# Altium schematic sheet TOP_LEVEL.SchDoc
size A3; Organization: ICNS, MARCS Institute; Address1: Werrington South Campus, Great Western Highway; Address2: Werrington, NSW, 2747; SheetNumber: 1; SheetTotal: 16
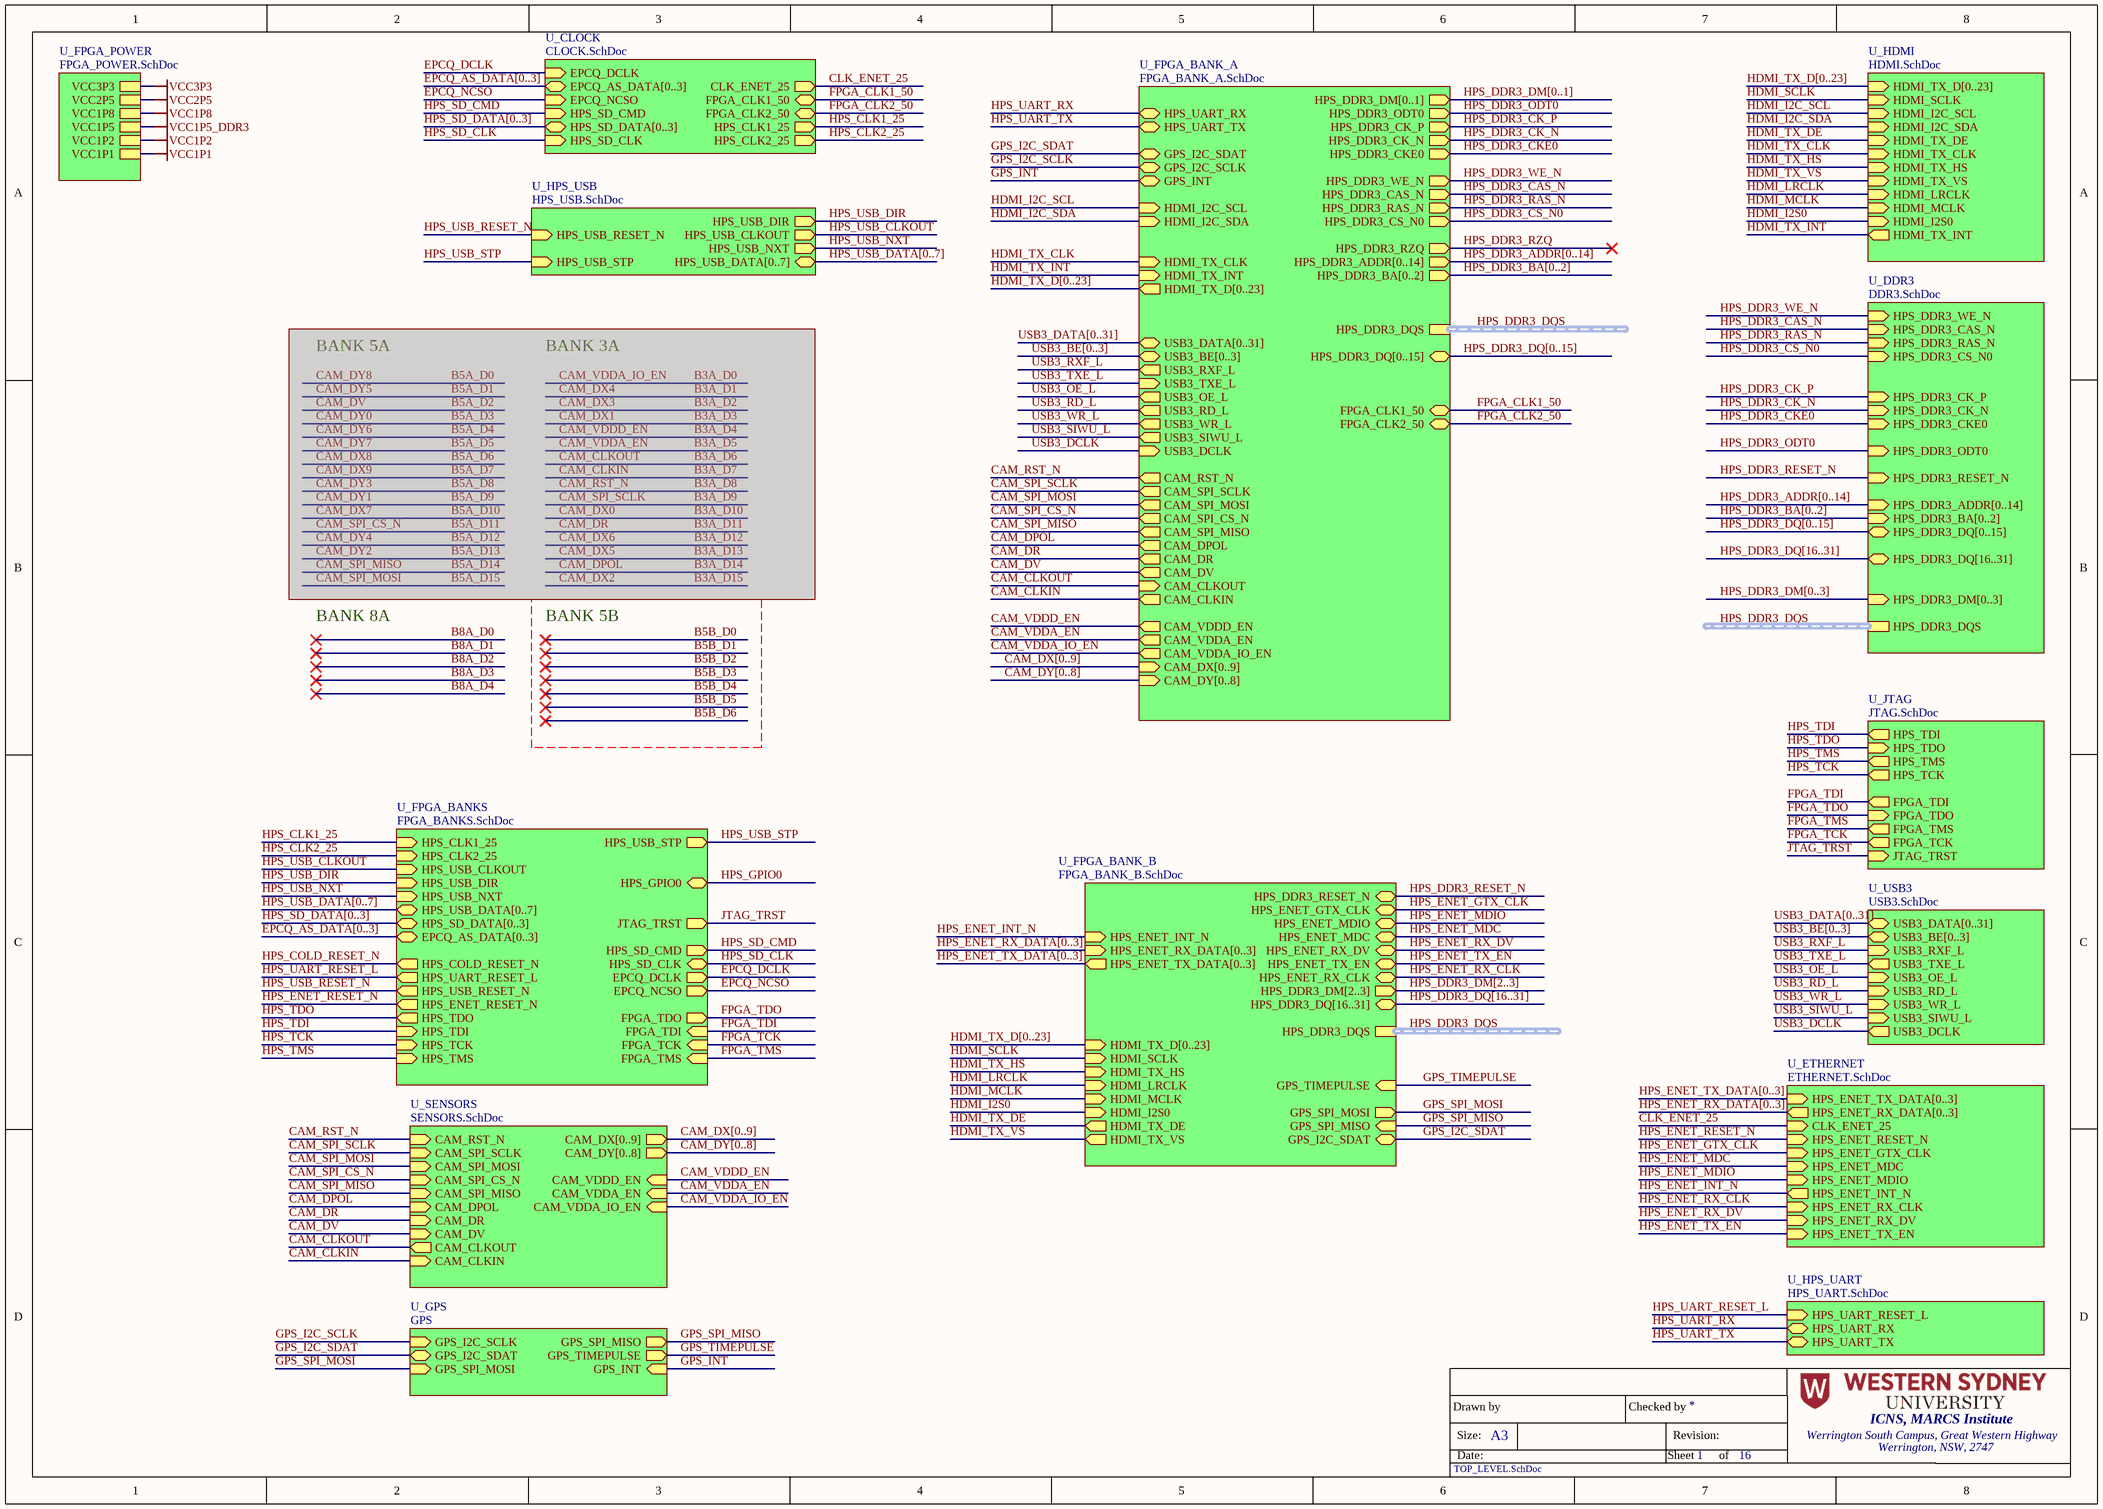
[diagram p0: TOP_LEVEL.SchDoc]

## Sub-sheets
U_CLOCK = CLOCK.SchDoc: CLK_ENET_25 (out), FPGA_CLK1_50 (bidir), FPGA_CLK2_50 (bidir), EPCQ_DCLK (in), EPCQ_AS_DATA[0..3] (bidir), EPCQ_NCSO (in), HPS_SD_CMD (in), HPS_SD_DATA[0..3] (bidir), HPS_SD_CLK (in), HPS_CLK1_25 (out), HPS_CLK2_25 (out)
U_DDR3 = DDR3.SchDoc: HPS_DDR3_WE_N (in), HPS_DDR3_CAS_N (in), HPS_DDR3_RAS_N (in), HPS_DDR3_CS_N0 (in), HPS_DDR3_CK_P (in), HPS_DDR3_CK_N (in), HPS_DDR3_CKE0 (in), HPS_DDR3_ODT0 (in), HPS_DDR3_RESET_N (in), HPS_DDR3_ADDR[0..14] (in), HPS_DDR3_BA[0..2] (in), HPS_DDR3_DQ[0..15] (bidir), HPS_DDR3_DQ[16..31] (bidir), HPS_DDR3_DM[0..3] (in), HPS_DDR3_DQS (harness DQS)
U_ETHERNET = ETHERNET.SchDoc: HPS_ENET_TX_DATA[0..3] (in), HPS_ENET_RX_DATA[0..3] (out), CLK_ENET_25 (in), HPS_ENET_RESET_N (in), HPS_ENET_GTX_CLK (in), HPS_ENET_MDC (in), HPS_ENET_MDIO (in), HPS_ENET_INT_N (out), HPS_ENET_RX_CLK (in), HPS_ENET_RX_DV (in), HPS_ENET_TX_EN (in)
U_FPGA_BANK_A = FPGA_BANK_A.SchDoc: HPS_UART_RX (bidir), HPS_UART_TX (bidir), GPS_I2C_SDAT (bidir), GPS_I2C_SCLK (bidir), FPGA_CLK1_50 (bidir), HPS_DDR3_DM[0..1] (out), HPS_DDR3_ODT0 (out), HPS_DDR3_CK_P (out), HPS_DDR3_CK_N (out), HPS_DDR3_CKE0 (out), HPS_DDR3_WE_N (out), HPS_DDR3_CAS_N (out), HPS_DDR3_RAS_N (out), HPS_DDR3_CS_N0 (out), HPS_DDR3_RZQ (out), HPS_DDR3_ADDR[0..14] (out), HPS_DDR3_DQ[0..15] (bidir), HPS_DDR3_BA[0..2] (out), FPGA_CLK2_50 (bidir), GPS_INT (bidir), HDMI_I2C_SCL (in), HDMI_I2C_SDA (in), HPS_DDR3_DQS (harness HPS_DDR3_DQS), HDMI_TX_CLK (in), USB3_DATA[0..31] (bidir), USB3_BE[0..3] (bidir), USB3_RXF_L (out), USB3_DCLK (in), USB3_TXE_L (in), USB3_OE_L (out), USB3_WR_L (out), USB3_SIWU_L (out), USB3_RD_L (out), HDMI_TX_D[0..23] (out), HDMI_TX_INT (in), CAM_SPI_SCLK (out), CAM_DPOL (out), CAM_SPI_CS_N (out), CAM_RST_N (out), CAM_SPI_MOSI (out), CAM_CLKIN (out), CAM_SPI_MISO (out), CAM_CLKOUT (in), CAM_DR (out), CAM_VDDA_EN (out), CAM_DV (out), CAM_VDDD_EN (out), CAM_DY[0..8] (in), CAM_VDDA_IO_EN (out), CAM_DX[0..9] (in)
U_FPGA_BANK_B = FPGA_BANK_B.SchDoc: HPS_DDR3_RESET_N (bidir), HPS_DDR3_DQ[16..31] (bidir), HPS_ENET_GTX_CLK (bidir), HPS_ENET_MDIO (bidir), HPS_ENET_MDC (bidir), HPS_ENET_RX_DV (bidir), HPS_ENET_TX_EN (bidir), HPS_ENET_RX_CLK (bidir), HPS_ENET_INT_N (in), HPS_ENET_TX_DATA[0..3] (out), HPS_ENET_RX_DATA[0..3] (in), HPS_DDR3_DM[2..3] (out), HPS_DDR3_DQS (harness HPS_DDR3_DQS), HDMI_SCLK (in), HDMI_TX_HS (in), HDMI_LRCLK (in), HDMI_MCLK (in), HDMI_I2S0 (in), GPS_SPI_MISO (in), GPS_SPI_MOSI (out), HDMI_TX_D[0..23] (in), HDMI_TX_DE (out), HDMI_TX_VS (out), GPS_TIMEPULSE (in), GPS_I2C_SDAT (bidir)
U_FPGA_BANKS = FPGA_BANKS.SchDoc: HPS_USB_CLKOUT (in), HPS_USB_STP (out), HPS_USB_DIR (in), HPS_USB_NXT (in), HPS_USB_DATA[0..7] (bidir), HPS_GPIO0 (bidir), HPS_TMS (in), HPS_TCK (in), HPS_TDO (out), HPS_TDI (in), JTAG_TRST (out), FPGA_TDI (in), FPGA_TDO (out), FPGA_TCK (in), FPGA_TMS (in), HPS_SD_CMD (out), HPS_SD_CLK (bidir), HPS_SD_DATA[0..3] (bidir), EPCQ_DCLK (out), EPCQ_NCSO (out), EPCQ_AS_DATA[0..3] (bidir), HPS_COLD_RESET_N (out), HPS_CLK1_25 (in), HPS_CLK2_25 (in), HPS_UART_RESET_L (out), HPS_USB_RESET_N (out), HPS_ENET_RESET_N (out)
U_FPGA_POWER = FPGA_POWER.SchDoc: VCC3P3, VCC2P5, VCC1P8, VCC1P5, VCC1P2, VCC1P1
U_GPS = GPS: GPS_TIMEPULSE (out), GPS_I2C_SDAT (bidir), GPS_SPI_MISO (out), GPS_I2C_SCLK (in), GPS_SPI_MOSI (in), GPS_INT (in)
U_HDMI = HDMI.SchDoc: HDMI_TX_D[0..23] (in), HDMI_SCLK (in), HDMI_I2C_SDA (in), HDMI_TX_DE (in), HDMI_TX_CLK (in), HDMI_TX_HS (in), HDMI_TX_VS (in), HDMI_LRCLK (in), HDMI_MCLK (in), HDMI_I2S0 (in), HDMI_I2C_SCL (in), HDMI_TX_INT (out)
U_HPS_UART = HPS_UART.SchDoc: HPS_UART_RESET_L (in), HPS_UART_RX (bidir), HPS_UART_TX (bidir)
U_HPS_USB = HPS_USB.SchDoc: HPS_USB_RESET_N (in), HPS_USB_DATA[0..7] (bidir), HPS_USB_DIR (out), HPS_USB_STP (in), HPS_USB_CLKOUT (out), HPS_USB_NXT (out)
U_JTAG = JTAG.SchDoc: HPS_TDI (out), HPS_TDO (in), HPS_TMS (out), HPS_TCK (out), FPGA_TDI (out), FPGA_TDO (in), FPGA_TMS (out), FPGA_TCK (out), JTAG_TRST (in)
U_SENSORS = SENSORS.SchDoc: CAM_SPI_SCLK (in), CAM_SPI_MOSI (in), CAM_SPI_CS_N (in), CAM_SPI_MISO (in), CAM_DPOL (in), CAM_DR (in), CAM_DV (in), CAM_CLKIN (in), CAM_DX[0..9] (out), CAM_DY[0..8] (out), CAM_RST_N (in), CAM_VDDA_EN (in), CAM_VDDD_EN (in), CAM_CLKOUT (out), CAM_VDDA_IO_EN (in)
U_USB3 = USB3.SchDoc: USB3_DATA[0..31] (bidir), USB3_BE[0..3] (bidir), USB3_TXE_L (out), USB3_RXF_L (in), USB3_OE_L (in), USB3_RD_L (in), USB3_WR_L (in), USB3_SIWU_L (in), USB3_DCLK (out)

## Nets
VCC1P1: sheet U_FPGA_POWER/VCC1P1
VCC1P2: sheet U_FPGA_POWER/VCC1P2
VCC1P5_DDR3: sheet U_FPGA_POWER/VCC1P5
VCC1P8: sheet U_FPGA_POWER/VCC1P8
VCC2P5: sheet U_FPGA_POWER/VCC2P5
VCC3P3: sheet U_FPGA_POWER/VCC3P3
CAM_CLKIN: sheet U_FPGA_BANK_A/CAM_CLKIN, sheet U_SENSORS/CAM_CLKIN
CAM_CLKOUT: sheet U_FPGA_BANK_A/CAM_CLKOUT, sheet U_SENSORS/CAM_CLKOUT
CAM_DPOL: sheet U_FPGA_BANK_A/CAM_DPOL, sheet U_SENSORS/CAM_DPOL
CAM_DR: sheet U_FPGA_BANK_A/CAM_DR, sheet U_SENSORS/CAM_DR
CAM_DV: sheet U_FPGA_BANK_A/CAM_DV, sheet U_SENSORS/CAM_DV
CAM_RST_N: sheet U_FPGA_BANK_A/CAM_RST_N, sheet U_SENSORS/CAM_RST_N
CAM_SPI_CS_N: sheet U_FPGA_BANK_A/CAM_SPI_CS_N, sheet U_SENSORS/CAM_SPI_CS_N
CAM_SPI_MISO: sheet U_FPGA_BANK_A/CAM_SPI_MISO, sheet U_SENSORS/CAM_SPI_MISO
CAM_SPI_MOSI: sheet U_FPGA_BANK_A/CAM_SPI_MOSI, sheet U_SENSORS/CAM_SPI_MOSI
CAM_SPI_SCLK: sheet U_FPGA_BANK_A/CAM_SPI_SCLK, sheet U_SENSORS/CAM_SPI_SCLK
CAM_VDDA_EN: sheet U_FPGA_BANK_A/CAM_VDDA_EN, sheet U_SENSORS/CAM_VDDA_EN
CAM_VDDA_IO_EN: sheet U_FPGA_BANK_A/CAM_VDDA_IO_EN, sheet U_SENSORS/CAM_VDDA_IO_EN
CAM_VDDD_EN: sheet U_FPGA_BANK_A/CAM_VDDD_EN, sheet U_SENSORS/CAM_VDDD_EN
CLK_ENET_25: sheet U_ETHERNET/CLK_ENET_25, sheet U_CLOCK/CLK_ENET_25
EPCQ_DCLK: sheet U_CLOCK/EPCQ_DCLK, sheet U_FPGA_BANKS/EPCQ_DCLK
EPCQ_NCSO: sheet U_CLOCK/EPCQ_NCSO, sheet U_FPGA_BANKS/EPCQ_NCSO
FPGA_CLK1_50: sheet U_FPGA_BANK_A/FPGA_CLK1_50, sheet U_CLOCK/FPGA_CLK1_50
FPGA_CLK2_50: sheet U_FPGA_BANK_A/FPGA_CLK2_50, sheet U_CLOCK/FPGA_CLK2_50
FPGA_TCK: sheet U_JTAG/FPGA_TCK, sheet U_FPGA_BANKS/FPGA_TCK
FPGA_TDI: sheet U_JTAG/FPGA_TDI, sheet U_FPGA_BANKS/FPGA_TDI
FPGA_TDO: sheet U_JTAG/FPGA_TDO, sheet U_FPGA_BANKS/FPGA_TDO
FPGA_TMS: sheet U_JTAG/FPGA_TMS, sheet U_FPGA_BANKS/FPGA_TMS
GPS_I2C_SCLK: sheet U_FPGA_BANK_A/GPS_I2C_SCLK, sheet U_GPS/GPS_I2C_SCLK
GPS_I2C_SDAT: sheet U_FPGA_BANK_A/GPS_I2C_SDAT, sheet U_FPGA_BANK_B/GPS_I2C_SDAT, sheet U_GPS/GPS_I2C_SDAT
GPS_INT: sheet U_FPGA_BANK_A/GPS_INT, sheet U_GPS/GPS_INT
GPS_SPI_MISO: sheet U_FPGA_BANK_B/GPS_SPI_MISO, sheet U_GPS/GPS_SPI_MISO
GPS_SPI_MOSI: sheet U_FPGA_BANK_B/GPS_SPI_MOSI, sheet U_GPS/GPS_SPI_MOSI
GPS_TIMEPULSE: sheet U_FPGA_BANK_B/GPS_TIMEPULSE, sheet U_GPS/GPS_TIMEPULSE
HDMI_I2C_SCL: sheet U_FPGA_BANK_A/HDMI_I2C_SCL, sheet U_HDMI/HDMI_I2C_SCL
HDMI_I2C_SDA: sheet U_FPGA_BANK_A/HDMI_I2C_SDA, sheet U_HDMI/HDMI_I2C_SDA
HDMI_I2S0: sheet U_FPGA_BANK_B/HDMI_I2S0, sheet U_HDMI/HDMI_I2S0
HDMI_LRCLK: sheet U_FPGA_BANK_B/HDMI_LRCLK, sheet U_HDMI/HDMI_LRCLK
HDMI_MCLK: sheet U_FPGA_BANK_B/HDMI_MCLK, sheet U_HDMI/HDMI_MCLK
HDMI_SCLK: sheet U_FPGA_BANK_B/HDMI_SCLK, sheet U_HDMI/HDMI_SCLK
HDMI_TX_CLK: sheet U_FPGA_BANK_A/HDMI_TX_CLK, sheet U_HDMI/HDMI_TX_CLK
HDMI_TX_DE: sheet U_FPGA_BANK_B/HDMI_TX_DE, sheet U_HDMI/HDMI_TX_DE
HDMI_TX_HS: sheet U_FPGA_BANK_B/HDMI_TX_HS, sheet U_HDMI/HDMI_TX_HS
HDMI_TX_INT: sheet U_FPGA_BANK_A/HDMI_TX_INT, sheet U_HDMI/HDMI_TX_INT
HDMI_TX_VS: sheet U_FPGA_BANK_B/HDMI_TX_VS, sheet U_HDMI/HDMI_TX_VS
HPS_CLK1_25: sheet U_CLOCK/HPS_CLK1_25, sheet U_FPGA_BANKS/HPS_CLK1_25
HPS_CLK2_25: sheet U_CLOCK/HPS_CLK2_25, sheet U_FPGA_BANKS/HPS_CLK2_25
HPS_COLD_RESET_N: sheet U_FPGA_BANKS/HPS_COLD_RESET_N
HPS_DDR3_CAS_N: sheet U_FPGA_BANK_A/HPS_DDR3_CAS_N, sheet U_DDR3/HPS_DDR3_CAS_N
HPS_DDR3_CK_N: sheet U_FPGA_BANK_A/HPS_DDR3_CK_N, sheet U_DDR3/HPS_DDR3_CK_N
HPS_DDR3_CK_P: sheet U_FPGA_BANK_A/HPS_DDR3_CK_P, sheet U_DDR3/HPS_DDR3_CK_P
HPS_DDR3_CKE0: sheet U_FPGA_BANK_A/HPS_DDR3_CKE0, sheet U_DDR3/HPS_DDR3_CKE0
HPS_DDR3_CS_N0: sheet U_FPGA_BANK_A/HPS_DDR3_CS_N0, sheet U_DDR3/HPS_DDR3_CS_N0
HPS_DDR3_ODT0: sheet U_FPGA_BANK_A/HPS_DDR3_ODT0, sheet U_DDR3/HPS_DDR3_ODT0
HPS_DDR3_RAS_N: sheet U_FPGA_BANK_A/HPS_DDR3_RAS_N, sheet U_DDR3/HPS_DDR3_RAS_N
HPS_DDR3_RESET_N: sheet U_DDR3/HPS_DDR3_RESET_N, sheet U_FPGA_BANK_B/HPS_DDR3_RESET_N
HPS_DDR3_RZQ: sheet U_FPGA_BANK_A/HPS_DDR3_RZQ
HPS_DDR3_WE_N: sheet U_FPGA_BANK_A/HPS_DDR3_WE_N, sheet U_DDR3/HPS_DDR3_WE_N
HPS_ENET_GTX_CLK: sheet U_ETHERNET/HPS_ENET_GTX_CLK, sheet U_FPGA_BANK_B/HPS_ENET_GTX_CLK
HPS_ENET_INT_N: sheet U_ETHERNET/HPS_ENET_INT_N, sheet U_FPGA_BANK_B/HPS_ENET_INT_N
HPS_ENET_MDC: sheet U_ETHERNET/HPS_ENET_MDC, sheet U_FPGA_BANK_B/HPS_ENET_MDC
HPS_ENET_MDIO: sheet U_ETHERNET/HPS_ENET_MDIO, sheet U_FPGA_BANK_B/HPS_ENET_MDIO
HPS_ENET_RESET_N: sheet U_ETHERNET/HPS_ENET_RESET_N, sheet U_FPGA_BANKS/HPS_ENET_RESET_N
HPS_ENET_RX_CLK: sheet U_ETHERNET/HPS_ENET_RX_CLK, sheet U_FPGA_BANK_B/HPS_ENET_RX_CLK
HPS_ENET_RX_DV: sheet U_ETHERNET/HPS_ENET_RX_DV, sheet U_FPGA_BANK_B/HPS_ENET_RX_DV
HPS_ENET_TX_EN: sheet U_ETHERNET/HPS_ENET_TX_EN, sheet U_FPGA_BANK_B/HPS_ENET_TX_EN
HPS_GPIO0: sheet U_FPGA_BANKS/HPS_GPIO0
HPS_SD_CLK: sheet U_CLOCK/HPS_SD_CLK, sheet U_FPGA_BANKS/HPS_SD_CLK
HPS_SD_CMD: sheet U_CLOCK/HPS_SD_CMD, sheet U_FPGA_BANKS/HPS_SD_CMD
HPS_TCK: sheet U_JTAG/HPS_TCK, sheet U_FPGA_BANKS/HPS_TCK
HPS_TDI: sheet U_JTAG/HPS_TDI, sheet U_FPGA_BANKS/HPS_TDI
HPS_TDO: sheet U_JTAG/HPS_TDO, sheet U_FPGA_BANKS/HPS_TDO
HPS_TMS: sheet U_JTAG/HPS_TMS, sheet U_FPGA_BANKS/HPS_TMS
HPS_UART_RESET_L: sheet U_FPGA_BANKS/HPS_UART_RESET_L, sheet U_HPS_UART/HPS_UART_RESET_L
HPS_UART_RX: sheet U_FPGA_BANK_A/HPS_UART_RX, sheet U_HPS_UART/HPS_UART_RX
HPS_UART_TX: sheet U_FPGA_BANK_A/HPS_UART_TX, sheet U_HPS_UART/HPS_UART_TX
HPS_USB_CLKOUT: sheet U_HPS_USB/HPS_USB_CLKOUT, sheet U_FPGA_BANKS/HPS_USB_CLKOUT
HPS_USB_DIR: sheet U_HPS_USB/HPS_USB_DIR, sheet U_FPGA_BANKS/HPS_USB_DIR
HPS_USB_NXT: sheet U_HPS_USB/HPS_USB_NXT, sheet U_FPGA_BANKS/HPS_USB_NXT
HPS_USB_RESET_N: sheet U_HPS_USB/HPS_USB_RESET_N, sheet U_FPGA_BANKS/HPS_USB_RESET_N
HPS_USB_STP: sheet U_HPS_USB/HPS_USB_STP, sheet U_FPGA_BANKS/HPS_USB_STP
JTAG_TRST: sheet U_JTAG/JTAG_TRST, sheet U_FPGA_BANKS/JTAG_TRST
USB3_DCLK: sheet U_FPGA_BANK_A/USB3_DCLK, sheet U_USB3/USB3_DCLK
USB3_OE_L: sheet U_FPGA_BANK_A/USB3_OE_L, sheet U_USB3/USB3_OE_L
USB3_RD_L: sheet U_FPGA_BANK_A/USB3_RD_L, sheet U_USB3/USB3_RD_L
USB3_RXF_L: sheet U_FPGA_BANK_A/USB3_RXF_L, sheet U_USB3/USB3_RXF_L
USB3_SIWU_L: sheet U_FPGA_BANK_A/USB3_SIWU_L, sheet U_USB3/USB3_SIWU_L
USB3_TXE_L: sheet U_FPGA_BANK_A/USB3_TXE_L, sheet U_USB3/USB3_TXE_L
USB3_WR_L: sheet U_FPGA_BANK_A/USB3_WR_L, sheet U_USB3/USB3_WR_L

## Buses and harness runs
bus CAM_DX[0..9] = sheet U_FPGA_BANK_A/CAM_DX[0..9]
bus CAM_DX[0..9] = sheet U_SENSORS/CAM_DX[0..9]
bus CAM_DY[0..8] = sheet U_FPGA_BANK_A/CAM_DY[0..8]
bus CAM_DY[0..8] = sheet U_SENSORS/CAM_DY[0..8]
bus EPCQ_AS_DATA[0..3] = sheet U_CLOCK/EPCQ_AS_DATA[0..3]
bus EPCQ_AS_DATA[0..3] = sheet U_FPGA_BANKS/EPCQ_AS_DATA[0..3]
bus HDMI_TX_D[0..23] = sheet U_FPGA_BANK_A/HDMI_TX_D[0..23]
bus HDMI_TX_D[0..23] = sheet U_FPGA_BANK_B/HDMI_TX_D[0..23]
bus HDMI_TX_D[0..23] = sheet U_HDMI/HDMI_TX_D[0..23]
bus HPS_DDR3_ADDR[0..14] = sheet U_DDR3/HPS_DDR3_ADDR[0..14]
bus HPS_DDR3_ADDR[0..14] = sheet U_FPGA_BANK_A/HPS_DDR3_ADDR[0..14]
bus HPS_DDR3_BA[0..2] = sheet U_DDR3/HPS_DDR3_BA[0..2]
bus HPS_DDR3_BA[0..2] = sheet U_FPGA_BANK_A/HPS_DDR3_BA[0..2]
bus HPS_DDR3_DM[0..1] = sheet U_FPGA_BANK_A/HPS_DDR3_DM[0..1]
bus HPS_DDR3_DM[0..3] = sheet U_DDR3/HPS_DDR3_DM[0..3]
bus HPS_DDR3_DM[2..3] = sheet U_FPGA_BANK_B/HPS_DDR3_DM[2..3]
bus HPS_DDR3_DQ[0..15] = sheet U_DDR3/HPS_DDR3_DQ[0..15]
bus HPS_DDR3_DQ[0..15] = sheet U_FPGA_BANK_A/HPS_DDR3_DQ[0..15]
bus HPS_DDR3_DQ[16..31] = sheet U_DDR3/HPS_DDR3_DQ[16..31]
bus HPS_DDR3_DQ[16..31] = sheet U_FPGA_BANK_B/HPS_DDR3_DQ[16..31]
bus HPS_ENET_RX_DATA[0..3] = sheet U_ETHERNET/HPS_ENET_RX_DATA[0..3]
bus HPS_ENET_RX_DATA[0..3] = sheet U_FPGA_BANK_B/HPS_ENET_RX_DATA[0..3]
bus HPS_ENET_TX_DATA[0..3] = sheet U_ETHERNET/HPS_ENET_TX_DATA[0..3]
bus HPS_ENET_TX_DATA[0..3] = sheet U_FPGA_BANK_B/HPS_ENET_TX_DATA[0..3]
bus HPS_SD_DATA[0..3] = sheet U_CLOCK/HPS_SD_DATA[0..3]
bus HPS_SD_DATA[0..3] = sheet U_FPGA_BANKS/HPS_SD_DATA[0..3]
bus HPS_USB_DATA[0..7] = sheet U_FPGA_BANKS/HPS_USB_DATA[0..7]
bus HPS_USB_DATA[0..7] = sheet U_HPS_USB/HPS_USB_DATA[0..7]
bus USB3_BE[0..3] = sheet U_FPGA_BANK_A/USB3_BE[0..3]
bus USB3_BE[0..3] = sheet U_USB3/USB3_BE[0..3]
bus USB3_DATA[0..31] = sheet U_FPGA_BANK_A/USB3_DATA[0..31]
bus USB3_DATA[0..31] = sheet U_USB3/USB3_DATA[0..31]
harness HPS_DDR3_DQS = sheet U_DDR3/HPS_DDR3_DQS
harness HPS_DDR3_DQS = sheet U_FPGA_BANK_A/HPS_DDR3_DQS
harness HPS_DDR3_DQS = sheet U_FPGA_BANK_B/HPS_DDR3_DQS

## Notes on the sheet
- BANK 5A
- BANK 3A
- BANK 8A
- BANK 5B
- Drawn by
- Size:
- Date:
- A3
- Checked by
- Sheet
- Revision:
- of